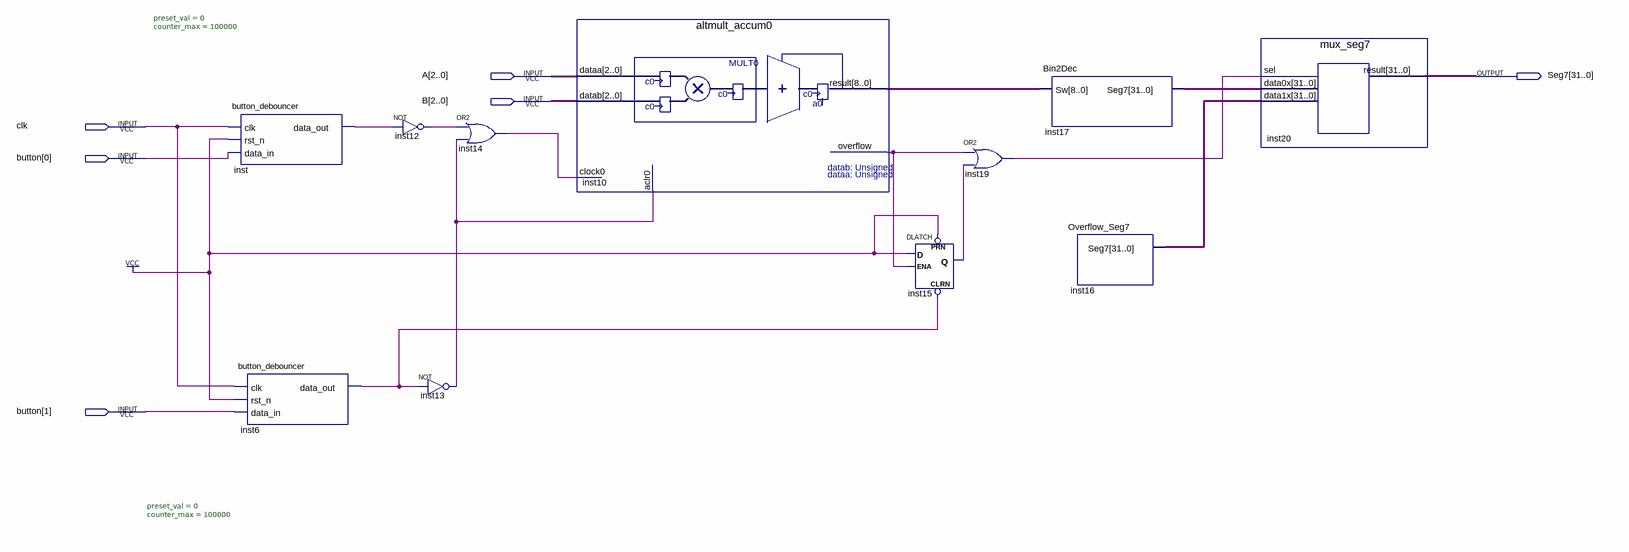
[diagram p0: schematic sheet]
// Quartus schematic Lab3.bdf as structural Verilog: 11 symbols, 6 pins
module Lab3 (
  input  [2:0] A,
  input  [2:0] B,
  input  clk,
  input  [1:0] button,
  output [31:0] Seg7
);

  wire inst6_data_out, inst10_overflow, inst12_out, inst13_out, inst14_out, inst15_q, inst19_out,
       inst_data_out;
  wire [8:0] inst10_result;
  wire [31:0] inst16_seg7, inst17_seg7;

  button_debouncer #(.preset_val(0), .counter_max(100000)) inst (
    .clk(clk), .rst_n(1'b1), .data_in(button[0]), .data_out(inst_data_out));
  button_debouncer #(.preset_val(0), .counter_max(100000)) inst6 (
    .clk(clk), .rst_n(1'b1), .data_in(button[1]), .data_out(inst6_data_out));
  not inst12 (inst12_out, inst_data_out);
  or inst14 (inst14_out, inst12_out, inst13_out);
  not inst13 (inst13_out, inst6_data_out);
  altmult_accum0 inst10 (
    .dataa(A), .datab(B), .clock0(inst14_out), .aclr0(inst13_out), .result(inst10_result),
    .overflow(inst10_overflow));
  DLATCH inst15 (.CLRN(inst6_data_out), .D(1'b1), .ENA(inst10_overflow), .PRN(1'b1), .Q(inst15_q));
  or inst19 (inst19_out, inst10_overflow, inst15_q);
  Bin2Dec inst17 (.Sw(inst10_result), .Seg7(inst17_seg7));
  Overflow_Seg7 inst16 (.Seg7(inst16_seg7));
  mux_seg7 inst20 (.sel(inst19_out), .data0x(inst17_seg7), .data1x(inst16_seg7), .result(Seg7));
endmodule
